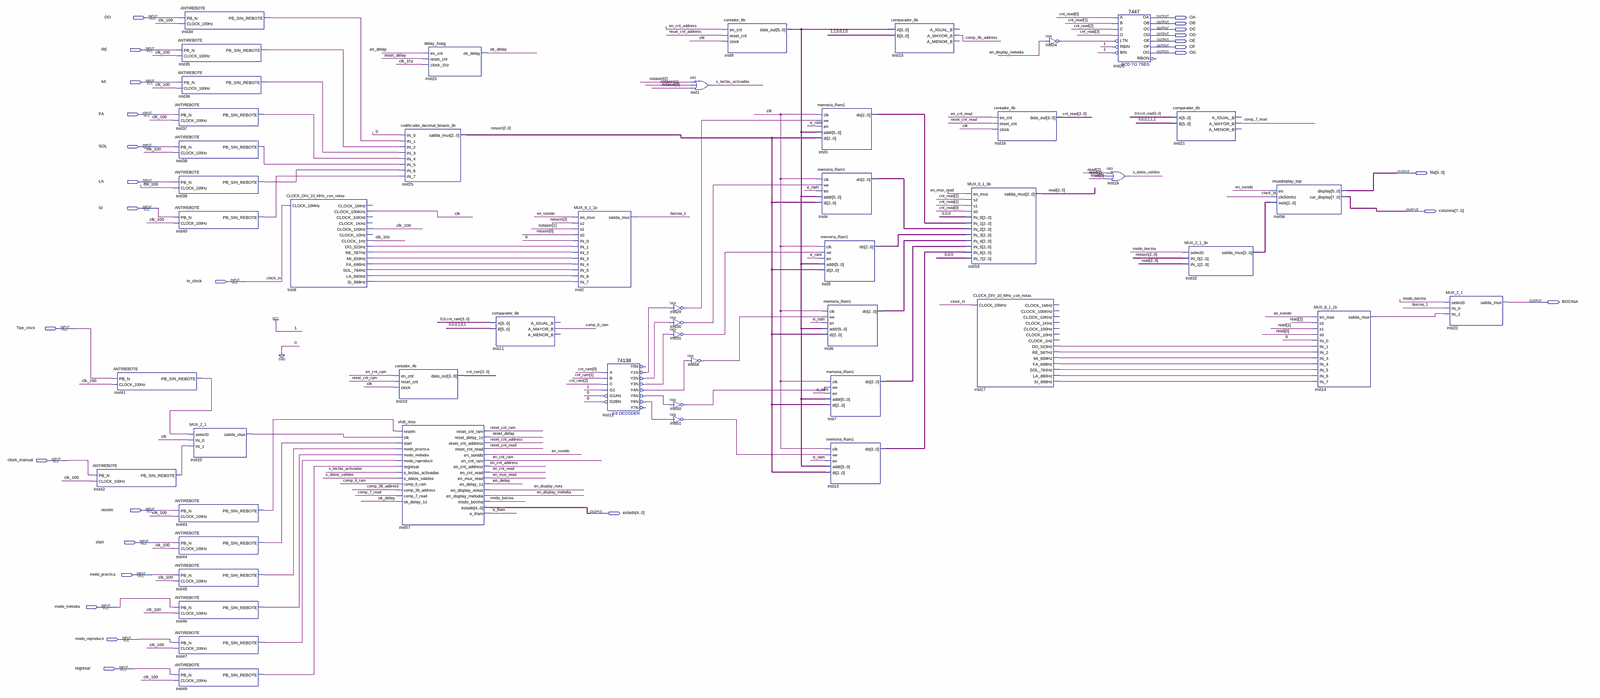
[diagram p0: schematic sheet, whole]
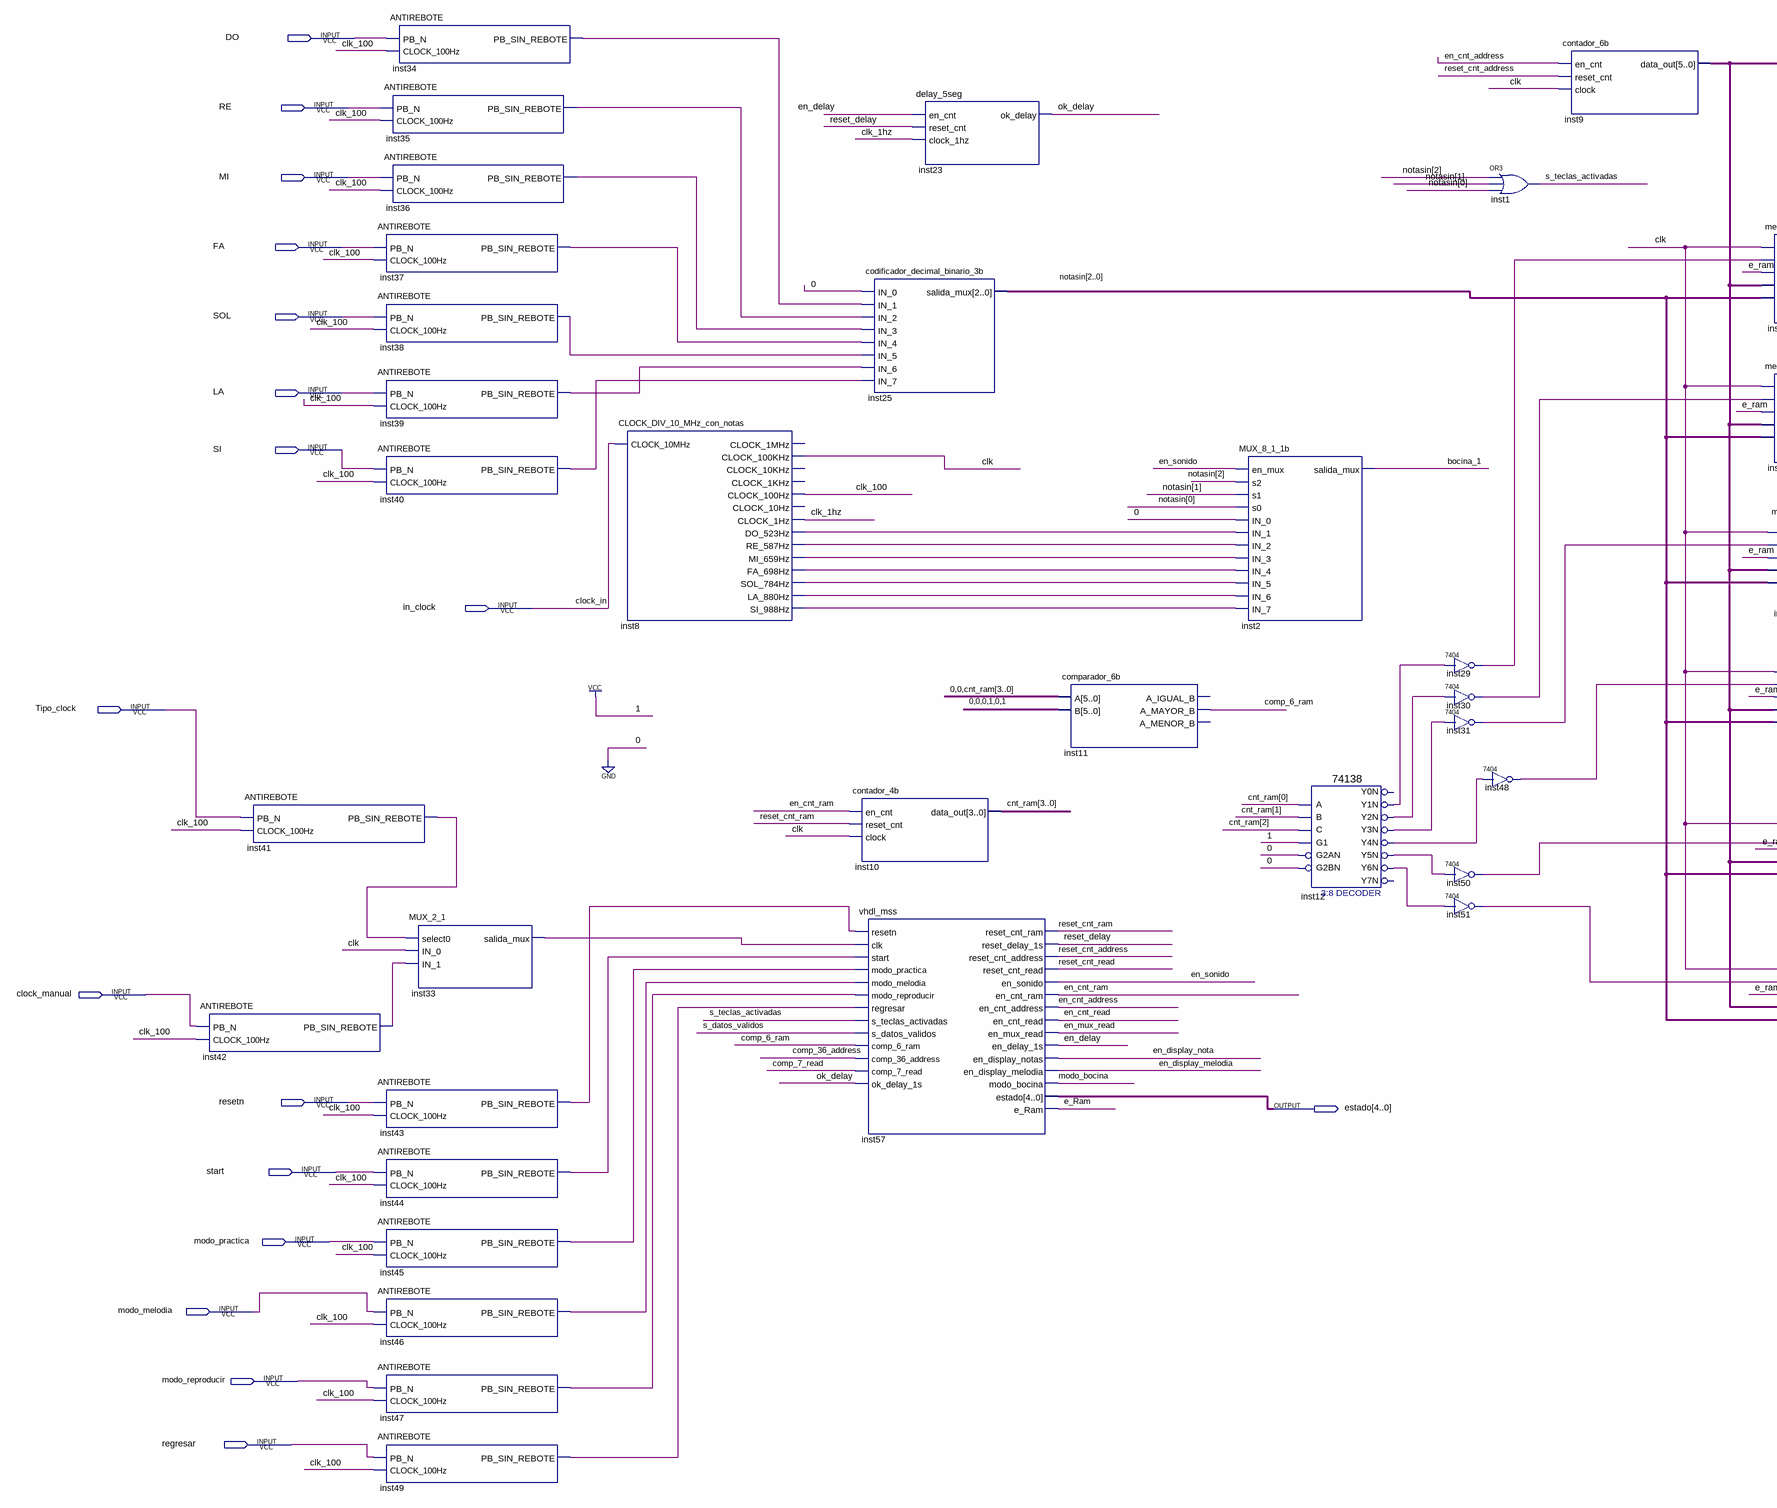
[diagram p1: schematic sheet, left part]
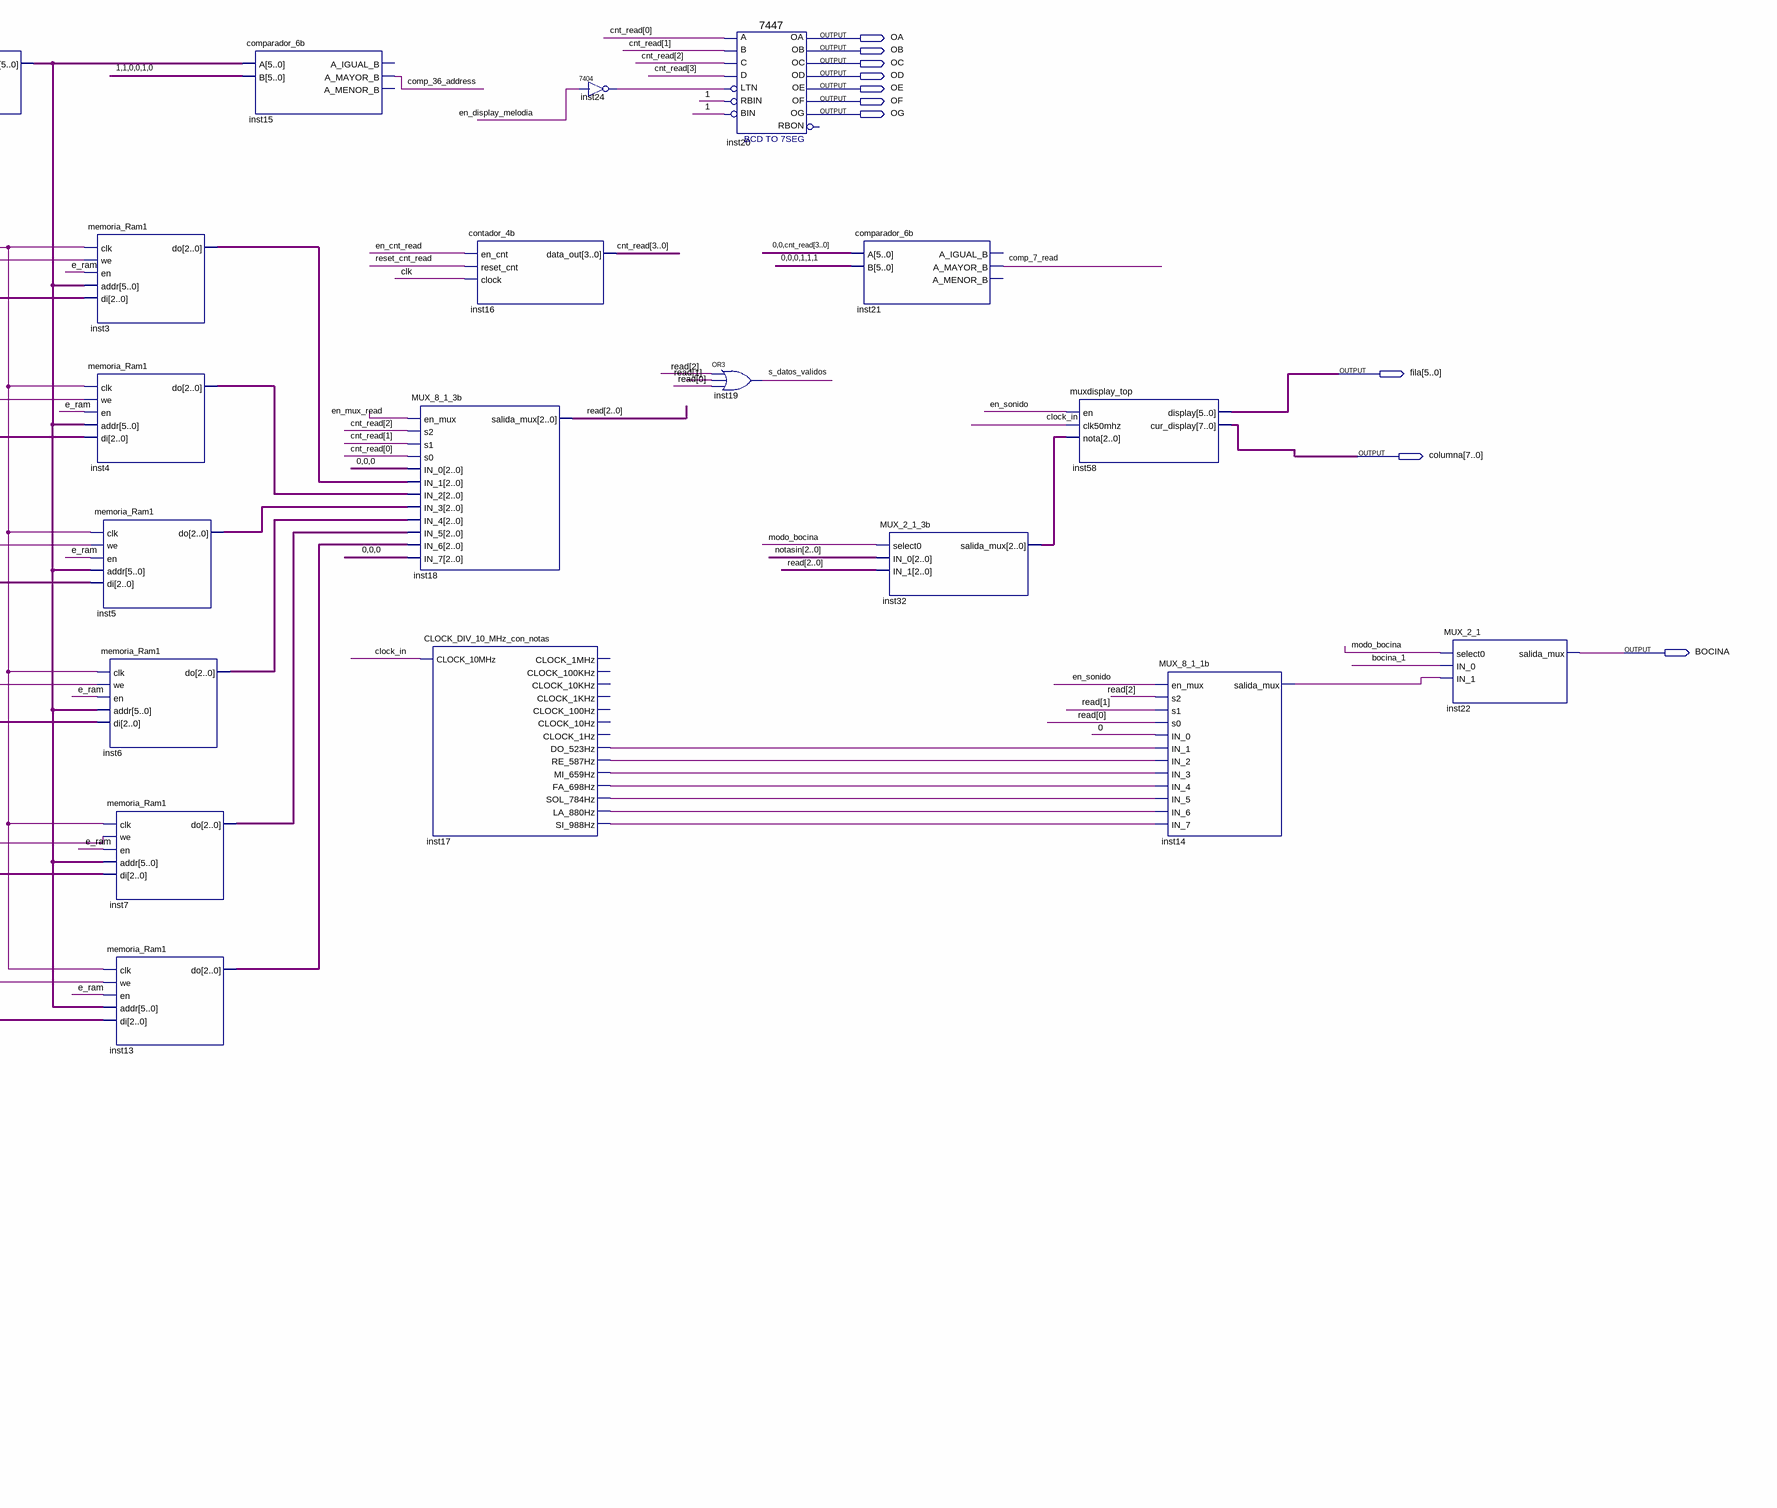
[diagram p2: schematic sheet, right part]
// Quartus schematic piano_1.bdf as structural Verilog: 50 symbols, 27 pins
module piano_1 (
  input  DO,
  input  RE,
  input  MI,
  input  FA,
  input  SOL,
  input  LA,
  input  SI,
  input  in_clock,
  input  Tipo_clock,
  input  clock_manual,
  input  resetn,
  input  start,
  input  modo_practica,
  input  modo_melodia,
  input  modo_reproducir,
  input  regresar,
  output OA,
  output OB,
  output OC,
  output OD,
  output OE,
  output OF,
  output OG,
  output [5:0] fila,
  output [7:0] columna,
  output BOCINA,
  output [4:0] estado
);

  wire bocina_1, clk, clk_1hz, clk_100, comp_6_ram, comp_7_read, comp_36_address, e_ram, en_cnt_address,
       en_cnt_ram, en_cnt_read, en_delay, en_display_melodia, en_display_nota, en_mux_read, en_sonido,
       inst8_do_523hz, inst8_fa_698hz, inst8_la_880hz, inst8_mi_659hz, inst8_re_587hz, inst8_si_988hz,
       inst8_sol_784hz, inst12_y1n, inst12_y2n, inst12_y3n, inst12_y4n, inst12_y5n, inst12_y6n,
       inst14_salida_mux, inst17_do_523hz, inst17_fa_698hz, inst17_la_880hz, inst17_mi_659hz,
       inst17_re_587hz, inst17_si_988hz, inst17_sol_784hz, inst24_1, inst29_1, inst30_1, inst31_1,
       inst33_salida_mux, inst34_pb_sin_rebote, inst35_pb_sin_rebote, inst36_pb_sin_rebote,
       inst37_pb_sin_rebote, inst38_pb_sin_rebote, inst39_pb_sin_rebote, inst40_pb_sin_rebote,
       inst41_pb_sin_rebote, inst42_pb_sin_rebote, inst43_pb_sin_rebote, inst44_pb_sin_rebote,
       inst45_pb_sin_rebote, inst46_pb_sin_rebote, inst47_pb_sin_rebote, inst48_1, inst49_pb_sin_rebote,
       inst50_1, inst51_1, modo_bocina, ok_delay, reset_cnt_address, reset_cnt_ram, reset_cnt_read,
       reset_delay, s_datos_validos, s_teclas_activadas;
  wire [2:0] inst3_do, inst4_do, inst5_do, inst6_do, inst7_do, inst13_do, inst32_salida_mux, notasin, read;
  wire [3:0] cnt_ram, cnt_read;
  wire [5:0] inst9_data_out;

  ANTIREBOTE inst42 (.PB_N(clock_manual), .CLOCK_100Hz(clk_100), .PB_SIN_REBOTE(inst42_pb_sin_rebote));
  ANTIREBOTE inst41 (.PB_N(Tipo_clock), .CLOCK_100Hz(clk_100), .PB_SIN_REBOTE(inst41_pb_sin_rebote));
  ANTIREBOTE inst34 (.PB_N(DO), .CLOCK_100Hz(clk_100), .PB_SIN_REBOTE(inst34_pb_sin_rebote));
  ANTIREBOTE inst35 (.PB_N(RE), .CLOCK_100Hz(clk_100), .PB_SIN_REBOTE(inst35_pb_sin_rebote));
  ANTIREBOTE inst36 (.PB_N(MI), .CLOCK_100Hz(clk_100), .PB_SIN_REBOTE(inst36_pb_sin_rebote));
  ANTIREBOTE inst37 (.PB_N(FA), .CLOCK_100Hz(clk_100), .PB_SIN_REBOTE(inst37_pb_sin_rebote));
  ANTIREBOTE inst38 (.PB_N(SOL), .CLOCK_100Hz(clk_100), .PB_SIN_REBOTE(inst38_pb_sin_rebote));
  ANTIREBOTE inst39 (.PB_N(LA), .CLOCK_100Hz(clk_100), .PB_SIN_REBOTE(inst39_pb_sin_rebote));
  ANTIREBOTE inst40 (.PB_N(SI), .CLOCK_100Hz(clk_100), .PB_SIN_REBOTE(inst40_pb_sin_rebote));
  ANTIREBOTE inst43 (.PB_N(resetn), .CLOCK_100Hz(clk_100), .PB_SIN_REBOTE(inst43_pb_sin_rebote));
  ANTIREBOTE inst44 (.PB_N(start), .CLOCK_100Hz(clk_100), .PB_SIN_REBOTE(inst44_pb_sin_rebote));
  ANTIREBOTE inst45 (.PB_N(modo_practica), .CLOCK_100Hz(clk_100), .PB_SIN_REBOTE(inst45_pb_sin_rebote));
  ANTIREBOTE inst46 (.PB_N(modo_melodia), .CLOCK_100Hz(clk_100), .PB_SIN_REBOTE(inst46_pb_sin_rebote));
  ANTIREBOTE inst47 (.PB_N(modo_reproducir), .CLOCK_100Hz(clk_100), .PB_SIN_REBOTE(inst47_pb_sin_rebote));
  ANTIREBOTE inst49 (.PB_N(regresar), .CLOCK_100Hz(clk_100), .PB_SIN_REBOTE(inst49_pb_sin_rebote));
  MUX_2_1 inst33 (
    .select0(inst41_pb_sin_rebote), .IN_0(clk), .IN_1(inst42_pb_sin_rebote), .salida_mux(inst33_salida_mux));
  CLOCK_DIV_10_MHz_con_notas inst8 (
    .CLOCK_10MHz(in_clock), .CLOCK_100KHz(clk), .CLOCK_100Hz(clk_100), .CLOCK_1Hz(clk_1hz),
    .DO_523Hz(inst8_do_523hz), .RE_587Hz(inst8_re_587hz), .MI_659Hz(inst8_mi_659hz),
    .FA_698Hz(inst8_fa_698hz), .SOL_784Hz(inst8_sol_784hz), .LA_880Hz(inst8_la_880hz),
    .SI_988Hz(inst8_si_988hz));  // open: CLOCK_1MHz, CLOCK_10KHz, CLOCK_1KHz, CLOCK_10Hz
  codificador_decimal_binario_3b inst25 (
    .IN_0(1'b0), .IN_1(inst34_pb_sin_rebote), .IN_2(inst35_pb_sin_rebote), .IN_3(inst36_pb_sin_rebote),
    .IN_4(inst37_pb_sin_rebote), .IN_5(inst38_pb_sin_rebote), .IN_6(inst39_pb_sin_rebote),
    .IN_7(inst40_pb_sin_rebote), .salida_mux(notasin));
  contador_4b inst10 (.en_cnt(en_cnt_ram), .reset_cnt(reset_cnt_ram), .clock(clk), .data_out(cnt_ram));
  vhdl_mss inst57 (
    .resetn(inst43_pb_sin_rebote), .clk(inst33_salida_mux), .start(inst44_pb_sin_rebote),
    .modo_practica(inst45_pb_sin_rebote), .modo_melodia(inst46_pb_sin_rebote),
    .modo_reproducir(inst47_pb_sin_rebote), .regresar(inst49_pb_sin_rebote),
    .s_teclas_activadas(s_teclas_activadas), .s_datos_validos(s_datos_validos), .comp_6_ram(comp_6_ram),
    .comp_36_address(comp_36_address), .comp_7_read(comp_7_read), .ok_delay_1s(ok_delay),
    .reset_cnt_ram(reset_cnt_ram), .reset_delay_1s(reset_delay), .reset_cnt_address(reset_cnt_address),
    .reset_cnt_read(reset_cnt_read), .en_sonido(en_sonido), .en_cnt_ram(en_cnt_ram),
    .en_cnt_address(en_cnt_address), .en_cnt_read(en_cnt_read), .en_mux_read(en_mux_read),
    .en_delay_1s(en_delay), .en_display_notas(en_display_nota), .en_display_melodia(en_display_melodia),
    .modo_bocina(modo_bocina), .estado(estado), .e_Ram(e_ram));
  delay_5seg inst23 (.en_cnt(en_delay), .reset_cnt(reset_delay), .clock_1hz(clk_1hz), .ok_delay(ok_delay));
  comparador_6b inst11 (.A({2'b00, cnt_ram}), .B(6'b000101), .A_MAYOR_B(comp_6_ram));  // open: A_IGUAL_B, A_MENOR_B
  MUX_8_1_1b inst2 (
    .en_mux(en_sonido), .s2(notasin[2]), .s1(notasin[1]), .s0(notasin[0]), .IN_0(1'b0),
    .IN_1(inst8_do_523hz), .IN_2(inst8_re_587hz), .IN_3(inst8_mi_659hz), .IN_4(inst8_fa_698hz),
    .IN_5(inst8_sol_784hz), .IN_6(inst8_la_880hz), .IN_7(inst8_si_988hz), .salida_mux(bocina_1));
  \74138  inst12 (
    .A(cnt_ram[0]), .B(cnt_ram[1]), .G1(1'b1), .C(cnt_ram[2]), .G2AN(1'b0), .G2BN(1'b0), .Y1N(inst12_y1n),
    .Y2N(inst12_y2n), .Y3N(inst12_y3n), .Y4N(inst12_y4n), .Y5N(inst12_y5n), .Y6N(inst12_y6n));  // open: Y0N, Y7N
  \7404  inst29 (.\2 (inst12_y1n), .\1 (inst29_1));
  \7404  inst30 (.\2 (inst12_y2n), .\1 (inst30_1));
  \7404  inst31 (.\2 (inst12_y3n), .\1 (inst31_1));
  \7404  inst50 (.\2 (inst12_y5n), .\1 (inst50_1));
  \7404  inst51 (.\2 (inst12_y6n), .\1 (inst51_1));
  or inst1 (s_teclas_activadas, notasin[2], notasin[1], notasin[0]);
  \7404  inst48 (.\2 (inst12_y4n), .\1 (inst48_1));
  contador_6b inst9 (.en_cnt(en_cnt_address), .reset_cnt(reset_cnt_address), .clock(clk), .data_out(inst9_data_out));
  memoria_Ram1 inst3 (.clk(clk), .we(inst29_1), .en(e_ram), .addr(inst9_data_out), .di(notasin), .\do (inst3_do));
  memoria_Ram1 inst4 (.clk(clk), .we(inst30_1), .en(e_ram), .addr(inst9_data_out), .di(notasin), .\do (inst4_do));
  memoria_Ram1 inst5 (.clk(clk), .we(inst31_1), .en(e_ram), .addr(inst9_data_out), .di(notasin), .\do (inst5_do));
  memoria_Ram1 inst6 (.clk(clk), .we(inst48_1), .en(e_ram), .addr(inst9_data_out), .di(notasin), .\do (inst6_do));
  memoria_Ram1 inst7 (.clk(clk), .we(inst50_1), .en(e_ram), .addr(inst9_data_out), .di(notasin), .\do (inst7_do));
  memoria_Ram1 inst13 (.clk(clk), .we(inst51_1), .en(e_ram), .addr(inst9_data_out), .di(notasin), .\do (inst13_do));
  comparador_6b inst15 (.A(inst9_data_out), .B(6'b110010), .A_MAYOR_B(comp_36_address));  // open: A_IGUAL_B, A_MENOR_B
  MUX_8_1_3b inst18 (
    .en_mux(en_mux_read), .s2(cnt_read[2]), .s1(cnt_read[1]), .s0(cnt_read[0]), .IN_0(3'b000),
    .IN_1(inst3_do), .IN_2(inst4_do), .IN_3(inst5_do), .IN_4(inst6_do), .IN_5(inst7_do), .IN_6(inst13_do),
    .IN_7(3'b000), .salida_mux(read));
  CLOCK_DIV_10_MHz_con_notas inst17 (
    .CLOCK_10MHz(in_clock), .DO_523Hz(inst17_do_523hz), .RE_587Hz(inst17_re_587hz),
    .MI_659Hz(inst17_mi_659hz), .FA_698Hz(inst17_fa_698hz), .SOL_784Hz(inst17_sol_784hz),
    .LA_880Hz(inst17_la_880hz), .SI_988Hz(inst17_si_988hz));  // open: CLOCK_1MHz, CLOCK_100KHz, CLOCK_10KHz, CLOCK_1KHz, CLOCK_100Hz, CLOCK_10Hz, CLOCK_1Hz
  contador_4b inst16 (.en_cnt(en_cnt_read), .reset_cnt(reset_cnt_read), .clock(clk), .data_out(cnt_read));
  \7404  inst24 (.\2 (en_display_melodia), .\1 (inst24_1));
  \7447  inst20 (
    .LTN(inst24_1), .B(cnt_read[1]), .C(cnt_read[2]), .D(cnt_read[3]), .RBIN(1'b1), .BIN(1'b1),
    .A(cnt_read[0]), .OB(OB), .OC(OC), .OE(OE), .OD(OD), .OF(OF), .OG(OG), .OA(OA));  // open: RBON
  or inst19 (s_datos_validos, read[2], read[1], read[0]);
  comparador_6b inst21 (.A({2'b00, cnt_read}), .B(6'b000111), .A_MAYOR_B(comp_7_read));  // open: A_IGUAL_B, A_MENOR_B
  MUX_2_1_3b inst32 (.select0(modo_bocina), .IN_0(notasin), .IN_1(read), .salida_mux(inst32_salida_mux));
  muxdisplay_top inst58 (
    .en(en_sonido), .clk50mhz(in_clock), .nota(inst32_salida_mux), .display(fila), .cur_display(columna));
  MUX_8_1_1b inst14 (
    .en_mux(en_sonido), .s2(read[2]), .s1(read[1]), .s0(read[0]), .IN_0(1'b0), .IN_1(inst17_do_523hz),
    .IN_2(inst17_re_587hz), .IN_3(inst17_mi_659hz), .IN_4(inst17_fa_698hz), .IN_5(inst17_sol_784hz),
    .IN_6(inst17_la_880hz), .IN_7(inst17_si_988hz), .salida_mux(inst14_salida_mux));
  MUX_2_1 inst22 (.select0(modo_bocina), .IN_0(bocina_1), .IN_1(inst14_salida_mux), .salida_mux(BOCINA));

  // Other names for the same wires on the sheet: clock_in = in_clock
endmodule
